# Altium schematic sheet High_Power.SchDoc
size 594 x 420 mm; SheetNumber: 3; SheetTotal: 3
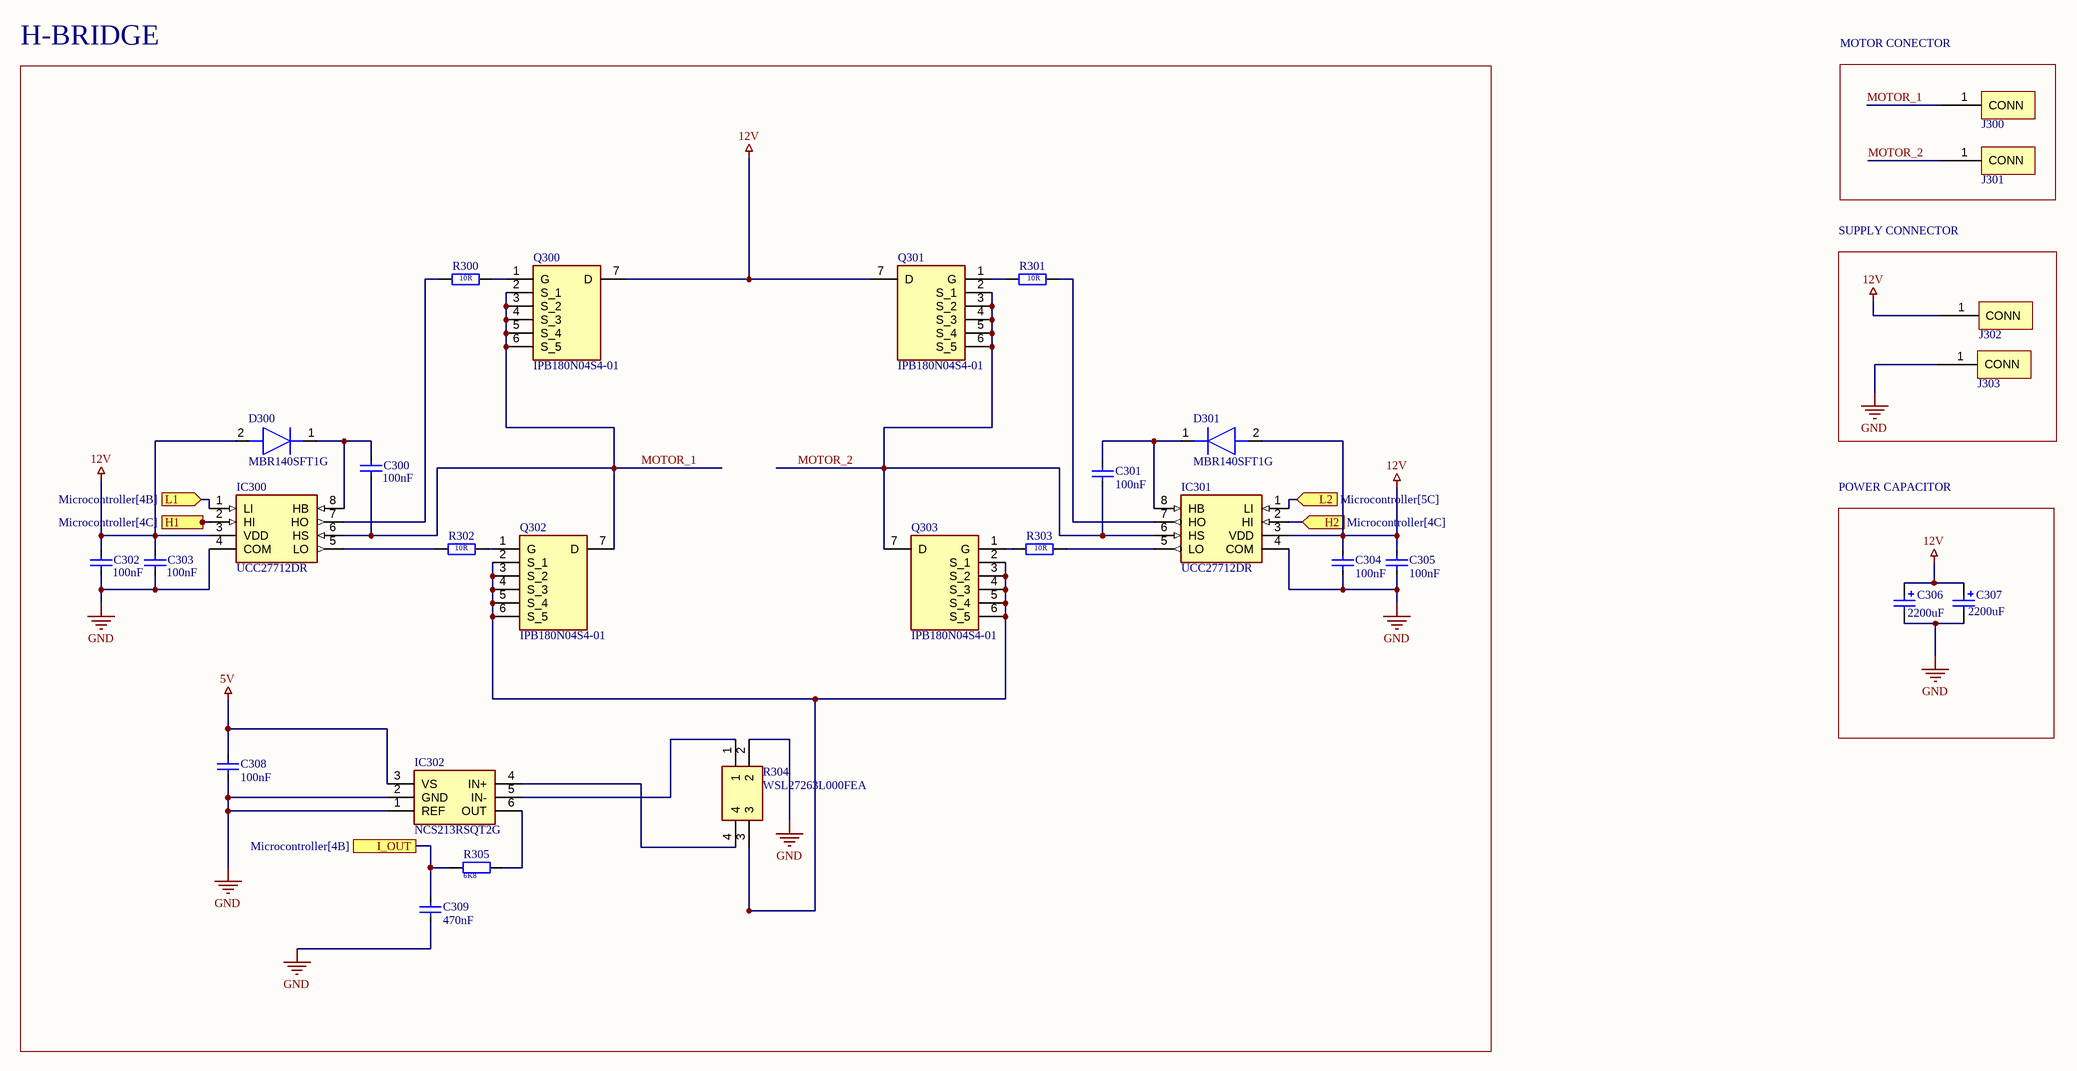
[diagram p0: High_Power.SchDoc]

## Parts
C300  value 100nF  [CAPC1608X09N]  (hidden comment: C)
C301  value 100nF  [CAPC1608X09N]  (hidden comment: C)
C302  value 100nF  [CAPC1608X09N]  (hidden comment: C)
C303  value 100nF  [CAPC1608X09N]  (hidden comment: C)
C304  value 100nF  [CAPC1608X09N]  (hidden comment: C)
C305  value 100nF  [CAPC1608X09N]  (hidden comment: C)
C306  value 2200uF  [Capacitor_12.5_20_5mm]  (hidden comment: Capacitor_12.5_20_5mm)
C307  value 2200uF  [Capacitor_12.5_20_5mm]  (hidden comment: Capacitor_12.5_20_5mm)
C308  value 100nF  [CAPC1608X09N]  (hidden comment: C)
C309  value 470nF  [CAPC1608X09N]  (hidden comment: C)
D300  MBR140SFT1G  [SODFL3616X98N]
D301  MBR140SFT1G  [SODFL3616X98N]
IC300  UCC27712DR  [SOIC127P600X175-8N]
IC301  UCC27712DR  [SOIC127P600X175-8N]
IC302  NCS213RSQT2G  [SOT65P210X110-6N]
J300  PCB_CONN  [T54105100-1050]  (value not drawn)
J301  PCB_CONN  [T54105100-1050]  (value not drawn)
J302  PCB_CONN  [T54105100-1050]  (value not drawn)
J303  PCB_CONN  [T54105100-1050]  (value not drawn)
Q300  IPB180N04S4-01  [IPB240N04S4R9ATMA1]
Q301  IPB180N04S4-01  [IPB240N04S4R9ATMA1]
Q302  IPB180N04S4-01  [IPB240N04S4R9ATMA1]
Q303  IPB180N04S4-01  [IPB240N04S4R9ATMA1]
R300  value 10R  [RESC3216X07N]  (hidden comment: R)
R301  value 10R  [RESC3216X07N]  (hidden comment: R)
R302  value 10R  [RESC3216X07N]  (hidden comment: R)
R303  value 10R  [RESC3216X07N]  (hidden comment: R)
R304  WSL27263L000FEA  [WSL27263L000FEA]
R305  value 6K8  [RESC1608X06N]  (hidden comment: R)

## Blocks framed on the sheet
H-BRIDGE: C300-C305 C308 C309 D300 D301 IC300-IC302 Q300-Q303 R300-R305
MOTOR CONECTOR: J300 J301
SUPPLY CONNECTOR: J302 J303
POWER CAPACITOR: C306 C307

## Ports
H1 (in, see Microcontroller[4C]), H2 (in, see Microcontroller[4C]), I_OUT (see Microcontroller[4B]), L1 (in, see Microcontroller[4B]), L2 (in, see Microcontroller[5C])

## Nets
5V: C308.2 IC302.3(VS)
12V: C302.2 C303.2 C304.2 C305.2 C306.1 C307.1 D300.2(A) D301.2(A) IC300.3(VDD) IC301.3(VDD) J302.1(CONN) Q300.7(D) Q301.7(D)
GND: C302.1 C303.1 C304.1 C305.1 C306.2 C307.2 C308.1 C309.2 IC300.4(COM) IC301.4(COM) IC302.1(REF) IC302.2(GND) J303.1(CONN) R304.2
H1: IC300.2(HI) ; port H1
H2: IC301.2(HI) ; port H2
I_OUT: C309.1 R305.2 ; port I_OUT
L1: IC300.1(LI) ; port L1
L2: IC301.1(LI) ; port L2
MOTOR_1: C300.1 IC300.6(HS) J300.1(CONN) Q300.2(S_1) Q300.3(S_2) Q300.4(S_3) Q300.5(S_4) Q300.6(S_5) Q302.7(D)
MOTOR_2: C301.1 IC301.6(HS) J301.1(CONN) Q301.2(S_1) Q301.3(S_2) Q301.4(S_3) Q301.5(S_4) Q301.6(S_5) Q303.7(D)
NetC300_2: C300.2 D300.1(K) IC300.8(HB)
NetC301_2: C301.2 D301.1(K) IC301.8(HB)
NetIC300_5: IC300.5(LO) R302.1
NetIC300_7: IC300.7(HO) R300.1
NetIC301_5: IC301.5(LO) R303.1
NetIC301_7: IC301.7(HO) R301.1
NetIC302_4: IC302.4(IN+) R304.4
NetIC302_5: IC302.5(IN-) R304.1
NetIC302_6: IC302.6(OUT) R305.1
NetQ300_1: Q300.1(G) R300.2
NetQ301_1: Q301.1(G) R301.2
NetQ302_1: Q302.1(G) R302.2
NetQ302_2: Q302.2(S_1) Q302.3(S_2) Q302.4(S_3) Q302.5(S_4) Q302.6(S_5) Q303.2(S_1) Q303.3(S_2) Q303.4(S_3) Q303.5(S_4) Q303.6(S_5) R304.3
NetQ303_1: Q303.1(G) R303.2

## Notes on the sheet
- DWG NO:
- REV:
- THIS DOCUMENT AND THE DATA DISCLOSED HEREIN OR
- HEREWITH IS THE PROPERTY OF ALTIUM LIMITED AND MAY
- BE FREELY DISTRIBUTED IN WHOLE. NO RIGHTS ARE
- RESERVED OR EXPRESS OR IMPLIED WARANTEE GIVEN.
- REVISION
- DESCRIPTION
- DATE
- APPROVED
- ENG:
- APPROVALS
- PROJECT
- DSN:
- CHK:
- REFERENCE DOCUMENTS
- PROJECT REVISION:
- TITLE
- DOCUMENT REVISION:
- DESIGN ITEM:
- BOM:
- FAB DWG:
- PCB DWG:
- ASSY DWG:
- SCALE:
- A2
- SIZE
- CAGE CODE
- FILE NAME
- DWG NO.
- SHEET
- OF
- REV

## Library data of the parts
C300-C305 C308 = C: MPN: 06033C104KAT4A; Link: https://www.lcsc.com/product-detail/Multilayer-Ceramic-Capacitors-MLCC-SMD-SMT_Kyocera-AVX-06033C104KAT4A_C2167104.html
C306 C307 = Capacitor_12.5_20_5mm: MPN: LKML2001E222MF; Link: https://www.lcsc.com/product-detail/Aluminum-Electrolytic-Capacitors-Leaded_Ymin-LKML2001E222MF_C442841.html?s_z=n_25YXJ2200M12.5X25
C309 = C: MPN: CS1608X7R474K250NRB; Link: https://www.lcsc.com/search?q=Samwha%20Capacitor%20CS1608X7R474K250NRB&s_z=n_Samwha%20Capacitor%20CS1608X7R474K250NRB
D300 D301 = MBR140SFT1G: Diode; Manufacturer_Name: onsemi; Datasheet Link: https://www.lcsc.com/datasheet/lcsc_datasheet_2410121940_onsemi-MBR140SFT1G_C43381.pdf; Height: 0.98mm; MPN: MBR140SFT1G; LCSC Part Number: C43381; LCSC Price/Stock: https://www.lcsc.com/product-detail/Schottky-Diodes_onsemi-MBR140SFT1G_C43381.html?s_z=n_MBR140SFT1G; Arrow Part Number: MBR140SFT1G; Link: https://www.lcsc.com/product-detail/Schottky-Diodes_onsemi-MBR140SFT1G_C43381.html?s_z=n_MBR140SFT1G
IC300 IC301 = UCC27712DR: Integrated Circuit; Manufacturer_Name: Texas Instruments; Datasheet Link: https://www.lcsc.com/datasheet/lcsc_datasheet_2410121944_Texas-Instruments-UCC27712DR_C485818.pdf; Height: 1.75mm; MPN: UCC27712DR; LCSC Part Number: C485818; LCSC Price/Stock: https://www.lcsc.com/product-detail/Gate-Drivers_Texas-Instruments-UCC27712DR_C485818.html?s_z=n_UCC27712DR; Arrow Part Number: UCC27712DR; Link: https://www.lcsc.com/product-detail/Gate-Drivers_Texas-Instruments-UCC27712DR_C485818.html?s_z=n_UCC27712DR
IC302 = NCS213RSQT2G: Integrated Circuit; Manufacturer_Name: onsemi; Datasheet Link: http://www.onsemi.com/pub/Collateral/NCS210R-D.PDF; Height: 1.1mm; MPN: NCS213RSQT2G; LCSC Part Number: 863-NCS213RSQT2G; LCSC Price/Stock: https://www.lcsc.com/product-detail/Current-Sense-Amplifiers_onsemi-NCS213RSQT2G_C603835.html?s_z=n_NCS213RSQT2G; Arrow Part Number: NCS213RSQT2G; Link: https://www.lcsc.com/product-detail/Current-Sense-Amplifiers_onsemi-NCS213RSQT2G_C603835.html?s_z=n_NCS213RSQT2G
J300-J303 = PCB_CONN: Manufacturer: XFCN; MPN: T54105100-1050; Link: https://www.lcsc.com/product-detail/PCB-Welding-Terminal_XFCN-T54105100-1050_C2689193.html?s_z=n_T54105100-1050
Q300-Q303 = IRFS3107-7PPBF: MOSFET (N-Channel); Manufacturer_Name: Infineon Technologies; Datasheet Link: https://www.lcsc.com/datasheet/lcsc_datasheet_2409301305_Infineon-Technologies-IPB180N04S4-01_C536569.pdf; Height: 4mm; MPN: IPB180N04S4-01; LCSC Part Number: C536569; LCSC Price/Stock: https://www.lcsc.com/product-detail/MOSFETs_Infineon-Technologies-IPB180N04S4-01_C536569.html; Arrow Part Number: IPB180N04S4-01; Link: https://www.lcsc.com/product-detail/MOSFETs_Infineon-Technologies-IPB180N04S4-01_C536569.html
R300-R303 = R: MPN: 1206W4F100JT5E; Link: https://www.lcsc.com/product-detail/Chip-Resistor-Surface-Mount_UNI-ROYAL-Uniroyal-Elec-1206W4F100JT5E_C17903.html
R304 = WSL27263L000FEA: Resistor; Manufacturer_Name: Shenzhen Yezhan Elec.; MPN: SBB-K-3J-n-t1; Datasheet Link: https://www.lcsc.com/datasheet/lcsc_datasheet_2411272144_Shenzhen-Yezhan-Elec--SBB-K-3J-n-t1_C503796.pdf; Height: 2.99mm; LCSC Part Number: C503796; LCSC Price/Stock: https://www.lcsc.com/product-detail/Current-Sense-Resistors-Shunt-Resistors_Shenzhen-Yezhan-Elec-SBB-K-3J-n-t1_C503796.html?s_z=n_shunt; Arrow Part Number: WSL27263L000FEA; Link: https://www.lcsc.com/product-detail/Current-Sense-Resistors-Shunt-Resistors_Shenzhen-Yezhan-Elec-SBB-K-3J-n-t1_C503796.html?s_z=n_shunt
R305 = R: MPN: RC0603FR-076K8L; Link: https://www.lcsc.com/product-detail/Chip-Resistor-Surface-Mount_YAGEO-RC0603FR-076K8L_C114632.html?s_z=n_YAGEO%20RC0603FR-076K8L